# Altium schematic sheet PAYL0001_GMSK.SchDoc: BLUEsat GMSK Modem
size A3; Engineer: M. WENKE, T. FISK; Organization: BLUEsat Project; Address1: Room 419; Address2: School of EE&T; Address3: UNSW, NSW 2052; Address4: Australia; DocumentNumber: PAYL0001; SheetNumber: 1; SheetTotal: 1; Description: GMSK Modem based on CML CMX589 IC; Version: 1.0
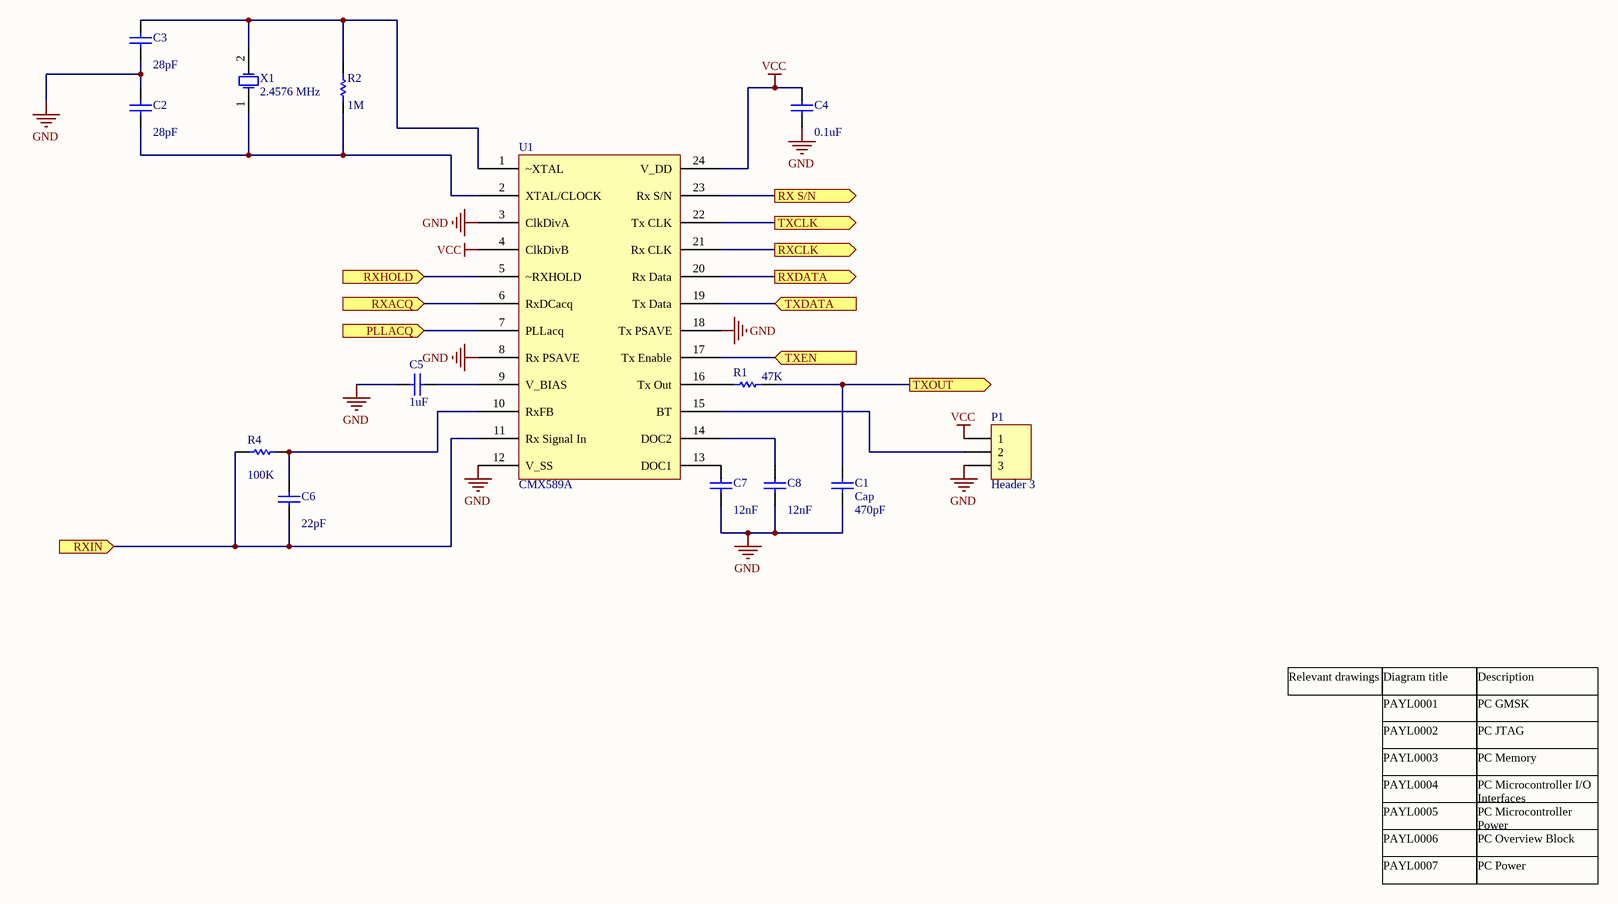
[diagram p0: PAYL0001_GMSK.SchDoc]

## Parts
C1  Cap  value 470pF  [C0805]
C2  value 28pF  [C0805]  (hidden comment: Cap)
C3  value 28pF  [C0805]  (hidden comment: Cap)
C4  value 0.1uF  [C0805]  (hidden comment: Cap)
C5  value 1uF  [C0805]  (hidden comment: Cap)
C6  value 22pF  [C0805]  (hidden comment: Cap)
C7  value 12nF  [C0805]  (hidden comment: Cap)
C8  value 12nF  [C0805]  (hidden comment: Cap)
P1  Header 3  [HDR1X3]
R1  value 47K  [C0805]  (hidden comment: Res1)
R2  value 1M  [C0805]  (hidden comment: Res1)
R4  value 100K  [C0805]  (hidden comment: Res1)
U1  CMX589A  [CMX589AD2]
X1  2.4576 MHz  [XTAL]

## Ports
PLLACQ (in), RX S/N (out), RXACQ (in), RXCLK (out), RXDATA (out), RXHOLD (in), RXIN (in), TXCLK (out), TXDATA (in), TXEN (in), TXOUT (out)

## Nets
GND: C1.1 C2.2 C3.1 C4.1 C5.1 C7.2 C8.2 P1.3 U1.3(ClkDivA) U1.8(Rx_PSAVE) U1.12(V_SS) U1.18(Tx_PSAVE)
VCC: C4.2 P1.1 U1.4(ClkDivB) U1.24(V_DD)
PLLACQ: U1.7(PLLacq) ; port PLLACQ
RX S/N: U1.23(Rx_S/N) ; port RX S/N
RXACQ: U1.6(RxDCacq) ; port RXACQ
RXCLK: U1.21(Rx_CLK) ; port RXCLK
RXDATA: U1.20(Rx_Data) ; port RXDATA
RXHOLD: U1.5(~RXHOLD) ; port RXHOLD
RXIN: C6.1 R4.1 U1.11(Rx_Signal_In) ; port RXIN
TXCLK: U1.22(Tx_CLK) ; port TXCLK
TXDATA: U1.19(Tx_Data) ; port TXDATA
TXEN: U1.17(Tx_Enable) ; port TXEN
TXOUT: C1.2 R1.2 ; port TXOUT
NetC2_1: C2.1 R2.1 U1.2(XTAL/CLOCK) X1.1(OSC1)
NetC3_2: C3.2 R2.2 U1.1(~XTAL) X1.2(OSC2)
NetC5_2: C5.2 U1.9(V_BIAS)
NetC6_2: C6.2 R4.2 U1.10(RxFB)
NetC7_1: C7.1 U1.13(DOC1)
NetC8_1: C8.1 U1.14(DOC2)
NetP1_2: P1.2 U1.15(BT)
NetR1_1: R1.1 U1.16(Tx_Out)

## Notes on the sheet
- Relevant drawings
- PAYL0001
- Diagram title
- PC GMSK
- Description
- PAYL0002
- PAYL0003
- PAYL0004
- PC JTAG
- PC Memory
- PC Microcontroller I/O Interfaces
- PAYL0005
- PAYL0006
- PC Microcontroller Power
- PC Overview Block
- PAYL0007
- PC Power
- Title
- Description:
- Size:
- Author:
- Date:
- A3
- Time:
- Version
- Sheet:
- Drawing No.:
- of
- File:

## Library data of the parts
C1-C8 = Cap: Capacitor; Published: 8-Jun-2000; LatestRevisionDate: 17-Jul-2002; LatestRevisionNote: Re-released for DXP Platform.; PackageReference: RAD-0.3; Publisher: Altium Limited; PackageDescription: Radial Cap, Thru-Hole; 2 Leads; 0.3 in Pin Spacing
P1 = Header 3: Header, 3-Pin; LatestRevisionDate: 17-Jul-2002; LatestRevisionNote: Re-released for DXP Platform.; Publisher: Altium Limited
R1 R2 R4 = Res1: Resistor; Published: 8-Jun-2000; LatestRevisionDate: 17-Jul-2002; LatestRevisionNote: Re-released for DXP Platform.; PackageReference: AXIAL-0.3; Publisher: Altium Limited; PackageDescription: Axial Device, Thru-Hole; 2 Leads; 0.3 in Pin Spacing
X1 = XTAL: Crystal Oscillator; Published: 8-Jun-2000; LatestRevisionDate: 17-Jul-2002; LatestRevisionNote: Re-released for DXP Platform.; PackageReference: R38; Publisher: Altium Limited; PackageDescription: Crystal, Thru-Hole; 2 Leads; Body 3.1 x 8.2 mm (Dia.xH)